# EAGLE schematic PLL_Counter_plain (EAGLE 6.3)
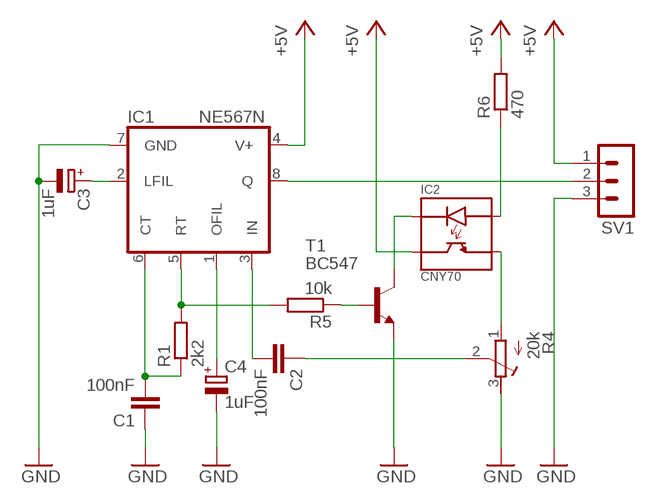
[diagram p0: schematic, sheet 1]

## Parts
C1  100nF  C-EU025-025X050  [C025-025X050]
C2  100nF  C-EU025-025X050  [C025-025X050]
C3  1uF  CPOL-EUE2.5-5  [E2,5-5]
C4  1uF  CPOL-EUE2.5-5  [E2,5-5]
IC1  NE567N  [DIL08]
IC2  CNY70  [CNY70]
R1  2k2  R-EU_0204/7  [0204/7]
R4  20k  R-TRIMM64X  [RTRIM64X]
R5  10k  R-EU_0204/7  [0204/7]
R6  470  R-EU_0204/7  [0204/7]
SV1  MA03-1  [MA03-1]
T1  BC547  [TO92]

## Nets
+5V: IC1.4(V+) IC2.DC R6.2 SV1.1
GND: C1.1 C3.- C4.- IC1.7(GND) R4.3(E) SV1.3 T1.1(E)
N$1: IC2.EK T1.3(C)
N$2: IC1.5(RT) R1.2 R5.2
N$3: C1.2 IC1.6(CT) R1.1
N$4: IC1.8(Q) SV1.2
N$6: C2.2 IC1.3(IN)
N$7: IC2.DE R4.1(A)
N$8: R5.1 T1.2(B)
N$10: IC2.EA R6.1
N$11: C3.+ IC1.2(LFIL)
N$12: C4.+ IC1.1(OFIL)
N$14: C2.1 R4.2(S)

## Library data of the parts
C1 C2 = resistor:C-EU: CAPACITOR, European symbol
C3 C4 = resistor:CPOL-EU: POLARIZED CAPACITOR, European symbol
IC1 = linear:*567: TONE DECODER
IC2 = CNY70:CNY70: CNY70 (Vishay) Reflexkoppler
R1 R5 R6 = resistor:R-EU_: RESISTOR, European symbol
R4 = rcl:R-TRIMM: Trimm resistor
SV1 = con-lstb:MA03-1: PIN HEADER; OC_FARNELL: unknown; OC_NEWARK: unknown
T1 = transistor:BC547: NPN TRANSISTOR